# EAGLE design SXV0300_Servo (EAGLE 9.6.2)
Selectrix Arduino
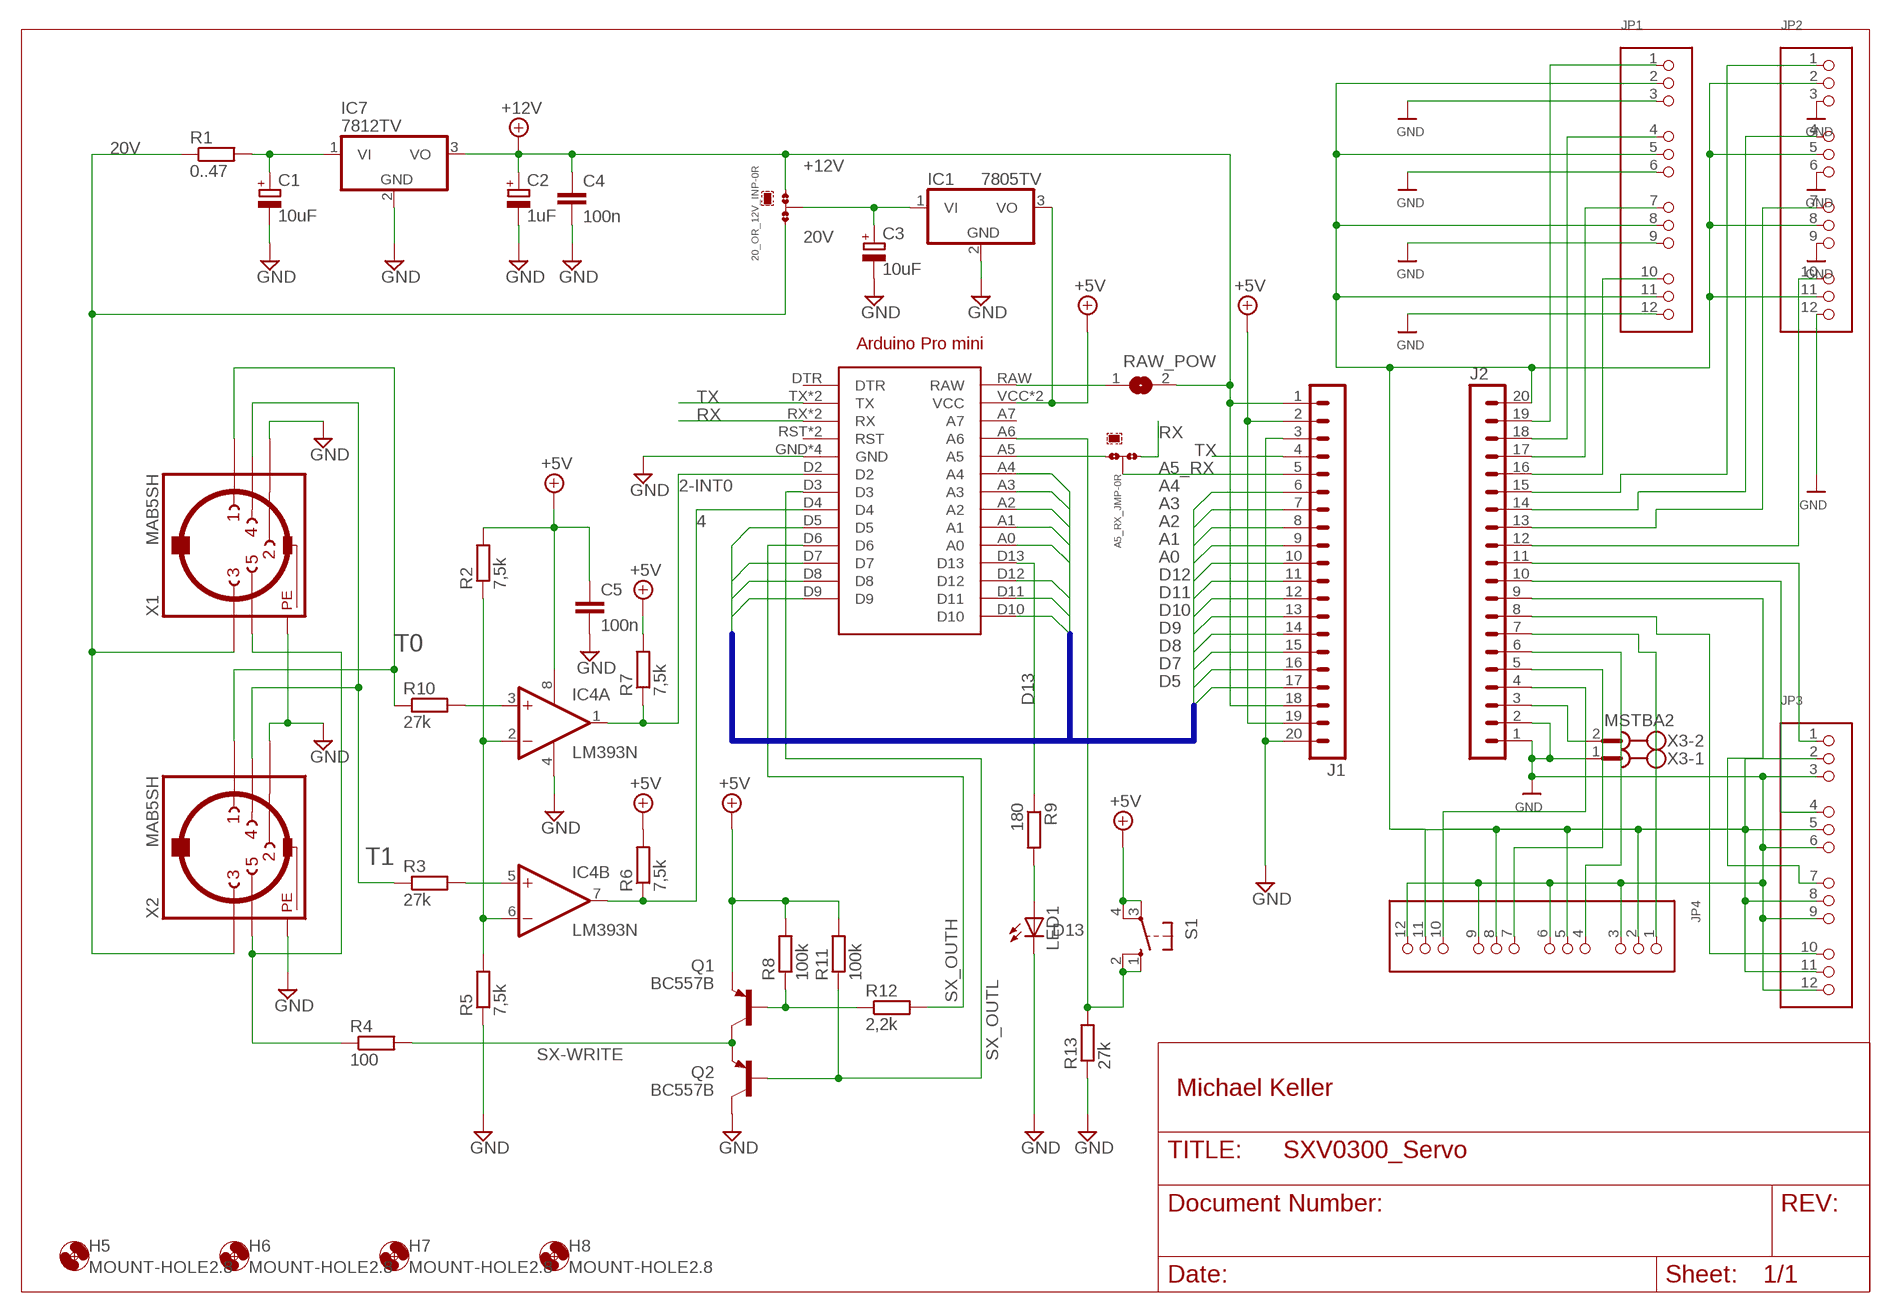
[diagram p0: schematic, sheet 1]

## Parts
20_OR_12V_INP  0R-JUMPA  [A0R-JMP]
A5_RX_JMP  0R-JUMPB  [B0R-JMP]
ARDUINO1  ARDUINO_PRO_MINI  [ARDUINO_PRO_MINI]
C1  10uF  CPOL-EUE2.5-7  [E2,5-7]
C2  1uF  CPOL-EUE2.5-7  [E2,5-7]
C3  10uF  CPOL-EUSMCC  [SMC_C]
C4  100n  C-EU050-025X075  [C050-025X075]
C5  100n  C-EU050-025X075  [C050-025X075]
H5  MOUNT-HOLE2.8  [2,8]
H6  MOUNT-HOLE2.8  [2,8]
H7  MOUNT-HOLE2.8  [2,8]
H8  MOUNT-HOLE2.8  [2,8]
IC1  7805TV  [TO220V]
IC4  LM393N  [DIL08]
IC7  7812TV  [TO220V]
J1  MA20-1  [MA20-1]
J2  MA20-1  [MA20-1]
JP1  HEADER-3X04  [3X04]
JP2  HEADER-3X04  [3X04]
JP3  HEADER-3X04  [3X04]
JP4  HEADER-3X04  [3X04]
LED1  LED3MM  [LED3MM]
Q1  BC557B  [TO92-EBC]
Q2  BC557B  [TO92-EBC]
R1  0..47  R-EU_0207/12  [0207/12]
R2  7,5k  R-EU_0207/10  [0207/10]
R3  27k  R-EU_0207/10  [0207/10]
R4  100  R-EU_0207/10  [0207/10]
R5  7,5k  R-EU_0207/10  [0207/10]
R6  7,5k  R-EU_0207/10  [0207/10]
R7  7,5k  R-EU_0207/10  [0207/10]
R8  100k  R-EU_0207/10  [0207/10]
R9  180  R-EU_0207/2V  [0207/2V]
R10  27k  R-EU_0207/10  [0207/10]
R11  100k  R-EU_0207/10  [0207/10]
R12  2,2k  R-EU_0207/10  [0207/10]
R13  27k  R-EU_0207/10  [0207/10]
RAW_POW  SJ  [SJ]
S1  10-XX  [B3F-10XX]
X1  MAB5SH  [MAB5SH]
X2  MAB5SH  [MAB5SH]
X3  MSTBA2  [MSTBA2]

## Nets
2-INT0: ARDUINO1.D2 IC4.1(A:OUT) R7.1
4: ARDUINO1.D4 IC4.7(B:OUT) R6.1
20V: 20_OR_12V_INP.3 R1.1 X1.3 X2.3
+5V: ARDUINO1.VCC ARDUINO1.VCC@1(VCC) C5.1 IC1.3(VO) IC4.8(P:V+) J1.2 J1.19 Q1.E R2.2 R6.2 R7.2 R8.2 R11.2 S1.3(P) S1.4(P1)
+12V: 20_OR_12V_INP.1 C2.+ C4.1 IC7.3(VO) J1.1 J1.18 RAW_POW.2
A0: ARDUINO1.A0 J1.10
A1: ARDUINO1.A1 J1.9
A2: ARDUINO1.A2 J1.8
A3: ARDUINO1.A3 J1.7
A4: ARDUINO1.A4 J1.6
A5: A5_RX_JMP.3 ARDUINO1.A5
A5_RX: A5_RX_JMP.2 J1.5
D5: ARDUINO1.D5 J1.17
D7: ARDUINO1.D7 J1.16
D8: ARDUINO1.D8 J1.15
D9: ARDUINO1.D9 J1.14
D10: ARDUINO1.D10 J1.13
D11: ARDUINO1.D11 J1.12
D12: ARDUINO1.D12 J1.11
D13: ARDUINO1.D13 R9.1
GND: ARDUINO1.GND ARDUINO1.GND@1(GND) ARDUINO1.GND@2(GND) ARDUINO1.GND@3(GND) C1.- C2.- C3.- C4.2 C5.2 IC1.2(GND) IC4.4(P:V-) IC7.2(GND) J1.3 J1.20 J2.1 J2.2 JP1.3 JP1.6 JP1.9 JP1.12 JP2.3 JP2.6 JP2.9 JP2.12 JP3.3 JP3.6 JP3.9 JP3.12 JP4.3 JP4.6 JP4.9 JP4.12 LED1.K(C) Q2.C R5.1 R13.1 X1.2 X1.PE X1.PE@1(PE) X1.PE@2(PE) X1.PE@(PE) X2.2 X2.PE X2.PE@1(PE) X2.PE@2(PE) X2.PE@(PE) X3.1
N$1: LED1.A R9.2
N$2: C1.+ IC7.1(VI) R1.2
N$3: R4.1 X1.5 X2.5
N$4: IC4.3(A:+IN) R10.2
N$5: IC4.5(B:+IN) R3.2
N$6: J2.20 JP1.2 JP1.5 JP1.8 JP1.11 JP2.2 JP2.5 JP2.8 JP2.11 JP3.2 JP3.5 JP3.8 JP3.11 JP4.2 JP4.5 JP4.8 JP4.11
N$7: IC4.2(A:-IN) IC4.6(B:-IN) R2.1 R5.2
N$9: J2.3 X3.2
N$10: J2.4 JP4.10
N$11: J2.5 JP4.7
N$12: J2.6 JP4.4
N$13: J2.7 JP4.1
N$14: J2.8 JP3.10
N$15: J2.9 JP3.7
N$16: J2.10 JP3.4
N$17: J2.11 JP3.1
N$18: J2.12 JP2.10
N$19: J2.13 JP2.7
N$20: J2.14 JP2.4
N$21: J2.15 JP2.1
N$22: J2.16 JP1.10
N$23: J2.17 JP1.7
N$24: J2.18 JP1.4
N$25: J2.19 JP1.1
N$27: ARDUINO1.A6 R13.2 S1.1(S) S1.2(S1)
N$28: Q1.B R8.1 R12.1
N$29: ARDUINO1.RAW RAW_POW.1
N$30: 20_OR_12V_INP.2 C3.+ IC1.1(VI)
RX: A5_RX_JMP.1 ARDUINO1.RX ARDUINO1.RX@1(RX)
SX-WRITE: Q1.C Q2.E R4.2
SX_OUTH: ARDUINO1.D6 R12.2
SX_OUTL: ARDUINO1.D3 Q2.B R11.1
T0: R10.1 X1.1 X2.1
T1: R3.1 X1.4 X2.4
TX: ARDUINO1.TX ARDUINO1.TX@1(TX) J1.4
Unconnected: ARDUINO1.A7 ARDUINO1.DTR ARDUINO1.RST ARDUINO1.RST@1(RST)

## Buses
D5,D[7..12],A[0..4]

## Notes on the sheet
- Michael Keller

## Library data of the parts
20_OR_12V_INP A5_RX_JMP = jump-0r-smd:0R-JUMP: SMD 0R 0805 Jumper
ARDUINO1 = arduinopromini:ARDUINO_PRO_MINI: For creating Arduino Pro Mini shields
C1 C2 = rcl:CPOL-EU: POLARIZED CAPACITOR, European symbol
C3 = resistor:CPOL-EU: POLARIZED CAPACITOR, European symbol
C4 C5 = rcl:C-EU: CAPACITOR, European symbol
H5-H8 = holes:MOUNT-HOLE: MOUNTING HOLE with drill center marker
IC1 IC7 = linear:78*: Positive VOLTAGE REGULATOR Source: http://cache.national.com/ds/LM/LM78L05.pdf http://www.fairchildsemi.com/ds/LM/LM7805.pdf
IC4 = linear:LM393: COMPARATOR
J1 J2 = con-lstb:MA20-1: PIN HEADER; OC_FARNELL: unknown; OC_NEWARK: unknown
JP1-JP4 = microbuilder:HEADER-3X04
LED1 = led:LED: LED OSRAM: - CHIPLED LG R971, LG N971, LY N971, LG Q971, LY Q971, LO R971, LY R971 LH N974, LH R974 LS Q976, LO Q976, LY Q976 LO Q996 - Hyper CHIPLED LW Q18S LB Q993, LB Q99A, LB R99A - SideLED LS A670, LO A670, LY A670, LG A670, LP A670 LB A673, LV A673, LT A673, LW A673 LH A674 LY A675 LS A676, LA A676, LO A676, LY A676, LW A676 LS A679, LY A679, LG A679 - Hyper Micro SIDELED® LS Y876, LA Y876, LO Y876, LY Y876 LT Y87S - SmartLED LW L88C, LW L88S LB L89C, LB L89S, LG L890 LS L89K, LO L89K, LY L89K LS L896, LA L896, LO L896, LY L896 - TOPLED LS T670, LO T670, LY T670, LG T670, LP T670 LSG T670, LSP T670, LSY T670, LOP T670, LYG T670 LG T671, LOG T671, LSG T671 LB T673, LV T673, LT T673, LW T673 LH T674 LS T676, LA T676, LO T676, LY T676, LB T676, LH T676, LSB T676, LW T676 LB T67C, LV T67C, LT T67C, LS T67K, LO T67K, LY T67K, LW E67C LS E67B, LA E67B, LO E67B, LY E67B, LB E67C, LV E67C, LT E67C LW T67C LS T679, LY T679, LG T679 LS T770, LO T770, LY T770, LG T770, LP T770 LB T773, LV T773, LT T773, LW T773 LH T774 LS E675, LA E675, LY E675, LS T675 LS T776, LA T776, LO T776, LY T776, LB T776 LHGB T686 LT T68C, LB T68C - Hyper Mini TOPLED® LB M676 - Mini TOPLED Santana® LG M470 LS M47K, LO M47K, LY M47K Source: http://www.osram.convergy.de LUXEON: - LUMILED® LXK2-PW12-R00, LXK2-PW12-S00, LXK2-PW14-U00, LXK2-PW14-V00 LXK2-PM12-R00, LXK2-PM12-S00, LXK2-PM14-U00 LXK2-PE12-Q00, LXK2-PE12-R00, LXK2-PE12-S00, LXK2-PE14-T00, LXK2-PE14-U00 LXK2-PB12-K00, LXK2-PB12-L00, LXK2-PB12-M00, LXK2-PB14-N00, LXK2-PB14-P00, LXK2-PB14-Q00 LXK2-PR12-L00, LXK2-PR12-M00, LXK2-PR14-Q00, LXK2-PR14-R00 LXK2-PD12-Q00, LXK2-PD12-R00, LXK2-PD12-S00 LXK2-PH12-R00, LXK2-PH12-S00 LXK2-PL12-P00, LXK2-PL12-Q00, LXK2-PL12-R00 Source: www.luxeon.com KINGBRIGHT: KA-3528ASYC Source: www.kingbright.com
Q1 Q2 = transistor-pnp:BC557*: PNP Transistror
R1-R13 = rcl:R-EU_: RESISTOR, European symbol
RAW_POW = jumper:SJ: SMD solder JUMPER
S1 = switch-omron:10-XX: OMRON SWITCH; MPN: B3F-1000; OC_FARNELL: 176432; OC_NEWARK: 36M3542
X1 X2 = con-hirschmann_Tha:MAB5SH: Female CONNECTOR 5 pins 90 deg. with shield, horizontal (DIN 41524); OC_FARNELL: 809883; OC_NEWARK: unknown
X3 = con-phoenix-508:MSTBA2: PHOENIX; MF: FARNELL; MPN: 1757242; OC_FARNELL: 3705171; OC_NEWARK: 71C4161

## Board
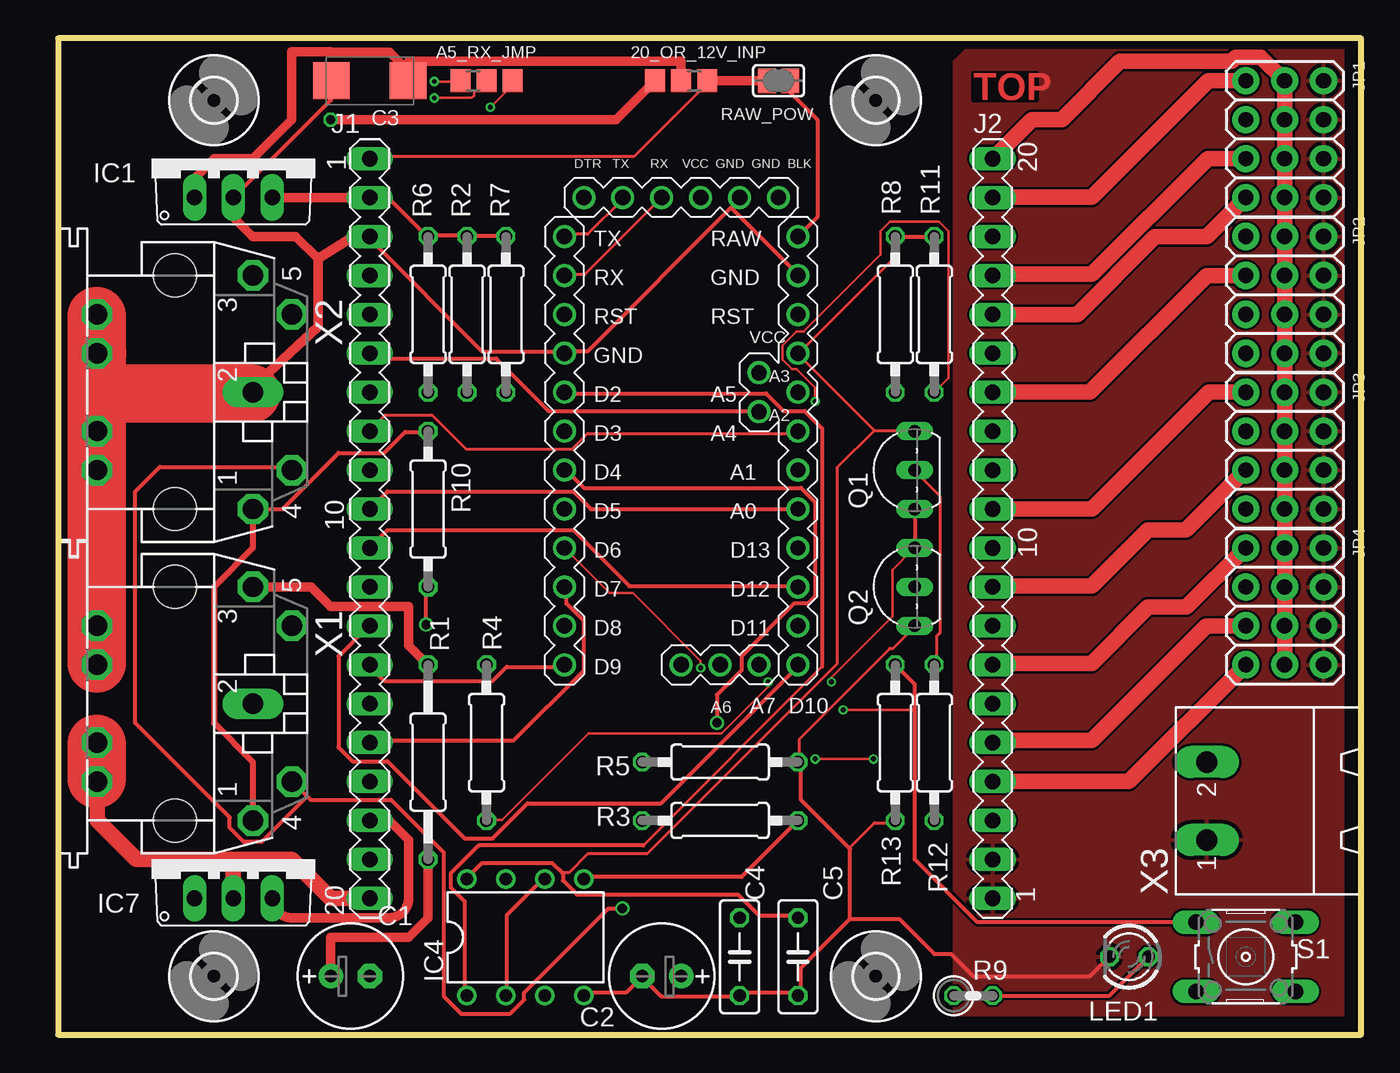
[diagram p1: board, top side]
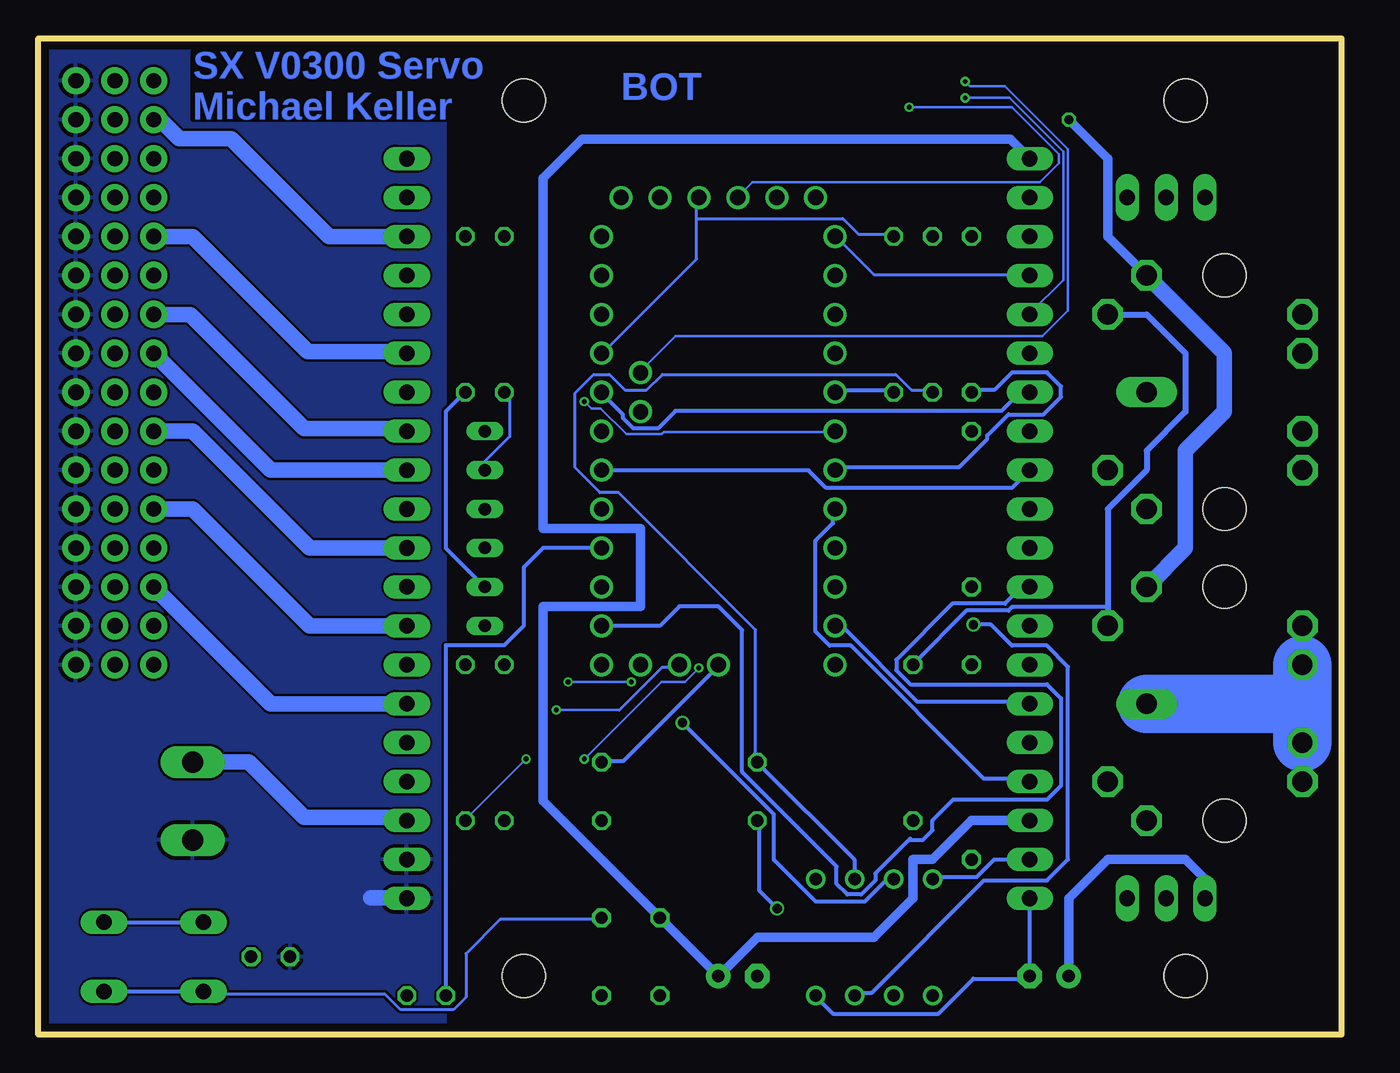
[diagram p2: board, bottom side, seen from below]

Size 85 x 65 mm. Coordinates in mm from the lower left corner, seen from the top.
Outline: 0,0 85,0 85,65 0,65 0,0
Copper layers (1*16): Top 0.035mm / dielectric 1.6mm / Bottom 0.035mm
Design rules "Elecrow_2-layer_PCB_eagle_rule": minimum track width 6mil, minimum drill 12mil, track to track 6mil, track to pad 6mil, pad to pad 6mil, via to via 8mil, smd to smd 0mil, copper to edge 20mil, drill to drill 10mil, minimum pad ring 6mil, minimum via ring 6mil, stop-mask expansion 0mil, vias tented up to drill 100mil, thermal gap 10mil

### Footprints (pad centres in the part's own frame; a part is rotated, then mirrored left to right if it is on the bottom)
A0R-JMP = smd 1.5 x 1.3: 1 0,1.7; 2 0,0; 3 0,-1.7
B0R-JMP = smd 1.5 x 1.3: 1 0,1.7; 2 0,0; 3 0,-1.7
ARDUINO_PRO_MINI = drill 1: A0 11.43,-8.89; A1 11.43,-6.35; A2 11.43,-3.81; A3 11.43,-1.27; A4 8.89,-2.54; A5 8.89,0; A6 6.35,-19.05; A7 8.89,-19.05; BLK 10.16,11.43; D2 -3.81,-1.27; D3 -3.81,-3.81; D4 -3.81,-6.35; D5 -3.81,-8.89; D6 -3.81,-11.43; D7 -3.81,-13.97; D8 -3.81,-16.51; D9 -3.81,-19.05; D10 11.43,-19.05; D11 11.43,-16.51; D12 11.43,-13.97; D13 11.43,-11.43; DTR -2.54,11.43; GND -3.81,1.27; GND@1 11.43,6.35; GND@2 7.62,11.43; GND@3 3.81,-19.05; RAW 11.43,8.89; RST 11.43,3.81; RST@1 -3.81,3.81; RX -3.81,6.35; RX@1 2.54,11.43; TX -3.81,8.89; TX@1 0,11.43; VCC 11.43,1.27; VCC@1 5.08,11.43
E2,5-7 = drill 0.813 pad 1.6: + -1.27,0 | drill 0.813 pad 1.6 octagon: - 1.27,0
SMC_C = smd 2.4 x 2.4: + -2.5,0; - 2.5,0
C050-025X075 = drill 0.813 octagon: 1 -2.54,0; 2 2.54,0
2,8 = hole 2.8: 0,0
TO220V = drill 1.016 long: 1 -2.54,-2.54; 2 0,-2.54; 3 2.54,-2.54
DIL08 = drill 0.813 pad 1.27: 1 -3.81,-3.81; 2 -1.27,-3.81; 3 1.27,-3.81; 4 3.81,-3.81; 5 3.81,3.81; 6 1.27,3.81; 7 -1.27,3.81; 8 -3.81,3.81
MA20-1 = drill 1.016 long: 1 -24.13,0; 2 -21.59,0; 3 -19.05,0; 4 -16.51,0; 5 -13.97,0; 6 -11.43,0; 7 -8.89,0; 8 -6.35,0; 9 -3.81,0; 10 -1.27,0; 11 1.27,0; 12 3.81,0; 13 6.35,0; 14 8.89,0; 15 11.43,0; 16 13.97,0; 17 16.51,0; 18 19.05,0; 19 21.59,0; 20 24.13,0
3X04 = drill 1 pad 1.778: 1 -3.81,-2.54; 2 -3.81,0; 3 -3.81,2.54; 4 -1.27,-2.54; 5 -1.27,0; 6 -1.27,2.54; 7 1.27,-2.54; 8 1.27,0; 9 1.27,2.54; 10 3.81,-2.54; 11 3.81,0; 12 3.81,2.54
LED3MM = drill 0.813 octagon: A -1.27,0; K 1.27,0
TO92-EBC = drill 0.813 long: B 0,-1.27; C -2.54,-1.27; E 2.54,-1.27
0207/12 = drill 0.813 octagon: 1 -6.35,0; 2 6.35,0
0207/10 = drill 0.813 octagon: 1 -5.08,0; 2 5.08,0
0207/2V = drill 0.813 octagon: 1 -1.27,0; 2 1.27,0
SJ = smd 1.168 x 1.6: 1 -0.762,0; 2 0.762,0
B3F-10XX = drill 1.016 long: 1 -3.251,2.261; 2 3.251,2.261; 3 -3.251,-2.261; 4 3.251,-2.261
MAB5SH = drill 1.321 octagon: 1 7.62,5.08; 3 -7.62,5.08; 4 5.08,7.62; 5 -5.08,7.62; PE -2.54,-5.08; PE@ 2.54,-5.08; PE@1 -5.08,-5.08; PE@2 5.08,-5.08 | drill 1.321 long: 2 0,5.08 | hole 2.794: 7.62,0; -7.62,0
MSTBA2 = drill 1.397 long: 1 -2.54,5.08; 2 2.54,5.08

### Placement (x,y rotation side)
20_OR_12V_INP  40.64,62.23 270 top
A5_RX_JMP  27.94,62.23 270 top
ARDUINO1  36.83,43.18 0 top
C1  19.05,3.81 0 top
C2  39.37,3.81 180 top
C3  20.32,62.23 180 top
C4  44.45,5.08 270 top
C5  48.26,5.08 270 top
H5  10.16,60.96 0 top
H6  53.34,60.96 0 top
H7  10.16,3.81 0 top
H8  53.34,3.81 0 top
IC1  11.43,57.15 0 top
IC4  30.48,6.35 0 top
IC7  11.43,11.43 0 top
J1  20.32,33.02 270 top
J2  60.96,33.02 90 top
JP1  80.01,58.42 270 top
JP2  80.01,48.26 270 top
JP3  80.01,38.1 270 top
JP4  80.01,27.94 270 top
LED1  69.85,5.08 180 top
Q1  54.61,36.83 90 top
Q2  54.61,29.21 90 top
R1  24.13,17.78 270 top
R2  26.67,46.99 90 top
R3  43.18,13.97 0 top
R4  27.94,19.05 270 top
R5  43.18,17.78 180 top
R6  24.13,46.99 90 top
R7  29.21,46.99 90 top
R8  54.61,46.99 90 top
R9  59.69,2.54 0 top
R10  24.13,34.29 270 top
R11  57.15,46.99 90 top
R12  57.15,19.05 270 top
R13  54.61,19.05 90 top
RAW_POW  46.99,62.23 180 top
S1  77.47,5.08 0 top
X1  7.62,21.59 270 top
X2  7.62,41.91 270 top
X3  80.01,15.24 90 top

### Tracks (layer width: path | path; a pad name or v marks a point on that pad's centre or on a via)
2-INT0
  Top 0.203: 38.18,12.34 38.2,12.39 49.78,23.98 49.84,24
  Top 0.254: 38.18,12.34 27.43,12.34 25.6,10.52 25.6,9.6 26.52,8.69 26.52,2.74 IC4.1 | 49.84,24 49.84,39.55 48.69,40.69 47.32,40.69 46.18,41.83 33.15,41.83 ARDUINO1.D2
  Bottom 0.254: R7.1 29.26,42.06 32.92,42.06 ARDUINO1.D2
4  (via drill 0.61)
  Top 0.254: v42.98,20.34 42.98,22.17 44.58,23.77 44.58,24.69 48.01,28.12 48.92,28.12 49.38,28.57 49.38,34.75 48.46,35.66 34.29,35.66 33.15,36.8 ARDUINO1.D4
  Bottom 0.254: R6.1 24,42.06 22.63,42.06 21.49,43.2 19.2,43.2 18.29,42.29 18.29,41.6 19.43,40.46 21.72,40.46 23.09,39.09 23.09,38.86 24.92,37.03 32.92,37.03 ARDUINO1.D4 | v42.98,20.34 37.03,14.4 37.03,11.43 34.29,8.69 31.09,8.69 29.72,10.06 29.26,10.06 IC4.7
20V  (via drill 0.6)
  Top 0.61: X1.3 16.51,29.21 17.78,27.94 22.86,27.94 22.86,25.4 R1.1 | v17.78,59.69 36.4,59.69 20_OR_12V_INP.3
  Bottom 0.61: X2.3 15.24,52.07 15.24,57.15 v17.78,59.69
  Bottom 1.016: X2.3 7.62,44.45 7.62,40.64 10.16,38.1 10.16,31.75 X1.3
+5V
  Top 0.203: 53.24,39.42 55.88,39.42 Q1.E | 53.24,39.42 48.36,44.3 ARDUINO1.VCC 48.36,44.5 54.46,50.6 54.46,52.02 R8.2 | 53.24,39.42 50.8,36.98 50.8,24.18 38.41,11.79 34.54,11.79 33.33,10.57 32.92,10.57 32.89,10.54
  Top 0.254: C5.1 48.23,7.77 45.72,7.77 44.35,9.14 33.83,9.14 32.92,10.06 32.92,10.52 32.89,10.54 32.23,11.2 27.66,11.2 26.75,10.29 IC4.8 | R7.2 29.03,52.12 26.75,52.12 R2.2 26.52,52.12 24.23,52.12 R6.2 24,52.12 21.72,54.41 20.34,54.41 J1.2 | R8.2 R11.2
  Top 0.61: IC1.3 J1.2
  Bottom 0.203: S1.3 74.17,2.64 62.38,2.64 61.37,1.63 57.91,1.63 57.1,2.44 57.1,5.28 54.86,7.52 48.36,7.52 C5.1 | 42.06,53.24 42.06,50.6 48.16,44.5 ARDUINO1.VCC | 42.06,53.24 42.06,54.46 ARDUINO1.VCC@1 | 42.06,53.24 32.51,53.24 31.5,52.22 29.26,52.22 R7.2
  Bottom 0.254: J1.19 22.63,11.43 23.77,10.29 26.52,10.29 IC4.8 | S1.4 S1.3
+12V
  Top 0.203: 20_OR_12V_INP.1 42.27,61.98 37.59,57.3 20.32,57.3 J1.1
  Top 0.61: IC7.3 arc90 15.24,7.62 21.59,7.62 arc90 22.86,8.89 22.86,12.7 21.59,13.97 J1.18 | 20_OR_12V_INP.1 RAW_POW.2
  Bottom 0.61: J1.18 24.13,13.97 26.67,11.43 27.94,11.43 27.94,8.89 30.48,6.35 38.1,6.35 C2.+ C4.1 52.07,15.24 52.07,27.94 45.72,27.94 45.72,33.02 52.07,33.02 52.07,55.88 49.53,58.42 21.59,58.42 J1.1
A0
  Top 0.254: ARDUINO1.A0 34.75,34.29 33.6,35.43 21.49,35.43 20.34,34.29 J1.10
A1
  Bottom 0.254: J1.9 21.49,35.66 33.6,35.66 34.75,36.8 48.23,36.8 ARDUINO1.A1
A2
  Top 0.203: ARDUINO1.A2 48.16,39.22 34.54,39.22 33.53,38.2 26.62,38.2 24.38,40.44 21.34,40.44 20.32,39.42 J1.8
A3
  Bottom 0.254: ARDUINO1.A3 48.23,41.83 46.86,40.46 46.86,40.23 46.18,39.55 44.58,39.55 43.43,40.69 22.17,40.69 21.03,41.83 20.34,41.83 J1.7
A4
  Top 0.254: ARDUINO1.A4 45.72,40.69 32,40.69 28.57,44.12 20.57,44.12 20.34,44.35 J1.6
A5  (via drill 0.3)
  Top 0.152: v24.54,62.18 26.21,62.18 A5_RX_JMP.3
  Bottom 0.152: ARDUINO1.A5 45.72,43.28 43.43,45.57 19.51,45.57 17.83,47.24 17.83,57.76 21.95,61.87 24.23,61.87 v24.54,62.18
A5_RX  (via drill 0.3)
  Top 0.152: A5_RX_JMP.2 27.13,61.42 27.13,61.27 26.98,61.11 v24.54,61.11
  Bottom 0.152: v24.54,61.11 21.64,61.11 18.14,57.61 18.14,49.23 20.27,47.09 J1.5
D5
  Bottom 0.254: ARDUINO1.D5 33.15,34.29 33.15,33.38 34.29,32.23 34.29,26.29 33.38,25.38 32,25.38 23.32,16.69 20.34,16.69 J1.17
D7
  Top 0.254: ARDUINO1.D7 33.15,29.03 33.15,28.12 34.29,26.98 34.29,23.77 29.72,19.2 20.34,19.2 J1.16
D8
  Bottom 0.254: ARDUINO1.D8 32.92,26.52 32.46,26.52 27.66,21.72 20.34,21.72 J1.15
D9
  Top 0.254: ARDUINO1.D9 32.92,24 29.26,24 28.35,23.09 21.26,23.09 20.34,24 J1.14
D10
  Top 0.254: ARDUINO1.D10 48.23,24 39.32,15.09 30.63,15.09 28.35,12.8 26.52,12.8 21.49,17.83 19.2,17.83 18.29,18.75 18.29,24.69 20.12,26.52 J1.13
D11
  Bottom 0.254: J1.12 20.34,29.03 21.03,29.03 21.95,28.12 25.38,28.12 29.03,24.46 29.03,23.77 28.12,22.86 19.2,22.86 18.29,21.95 18.29,16.23 19.2,15.32 25.32,15.32 26.67,13.97 26.67,13.34 27.3,12.7 28.12,12.7 28.12,12.8 30.4,10.52 30.4,10.06 31.32,9.14 32.23,9.14 32.92,9.83 32.92,10.97 39.09,17.14 39.09,26.39 40.64,27.94 43.18,27.94 44.45,26.67 ARDUINO1.D11
D12
  Top 0.254: J1.11 21.49,32.92 33.6,32.92 37.26,29.26 48.23,29.26 ARDUINO1.D12
D13
  Bottom 0.254: ARDUINO1.D13 52.07,31.75 53.34,30.48 53.34,26.67 54.61,25.4 58.42,25.4 R9.1
GND
  Top 0.203: ARDUINO1.GND@2 44.3,54.46 44.35,54.41 | R13.1 54.46,13.82 53.24,13.82 51.61,12.19 51.66,12.12 | Q2.C 55.88,26.62 54.46,25.2 54.25,25.2 48.36,19.3 48.36,17.88 R5.1 | 48.46,2.85 48.16,2.85 C5.2
  Top 0.254: 2.52,37.03 X2.PE@2 2.52,36.8 | 2.52,39.32 X2.PE@ 2.52,39.55 | 2.52,44.58 X2.PE | 2.52,46.86 X2.PE@1 | 2.52,16.69 X1.PE@2 | 2.52,18.97 X1.PE@ | 2.52,24.23 X1.PE | 2.52,26.52 X1.PE@1 2.52,26.75 | X2.2 12.57,41.83 13.72,43.2 | 18.97,51.89 J1.3 20.34,51.89 27.66,44.58 32.92,44.58 ARDUINO1.GND 33.15,44.58 34.52,44.58 43.89,53.95 | C5.2 48.23,2.74 44.58,2.74 C4.2 44.35,2.52 39.32,2.52 38.18,3.66 C2.- 37.03,2.74 34.29,2.74 IC4.4 | 51.66,7.54 54.86,7.54 57.15,5.26 58.24,5.26 59.69,3.81 67.31,3.81 LED1.K 68.58,5.26 | 51.66,7.54 48.46,4.34 48.46,2.85 | 44.35,54.41 43.89,53.95 | 43.89,53.95 48.23,49.61 ARDUINO1.GND@1 | 51.66,7.54 51.66,12.12 48.46,15.32 48.46,17.6 R5.1 | IC1.2 17.78,60.96 C3.-
  Top 0.61: 16.94,50.62 18.97,51.89 | 16.94,50.62 16.94,46.18 13.72,43.2 | IC1.2 11.43,53.34 12.7,52.07 15.49,52.07 16.94,50.62
  Top 1.016: X1.PE@2 2.54,13.97 5.08,11.43 11.43,11.43 | IC7.2 11.43,11.43 | 11.43,11.43 15.24,11.43 17.78,8.89 J1.20
  Top 3.81: 2.52,39.32 2.52,37.03 | 2.52,46.86 2.52,44.58 | 2.52,41.83 2.52,44.35 X2.PE | 2.52,41.83 2.52,39.55 | 2.52,18.97 2.52,16.69 | 2.52,26.52 2.52,24.23 | 2.52,26.75 2.52,36.8 | 2.52,41.83 12.57,41.83
  Bottom 0.254: R5.1 48.23,17.83 46.86,17.83 40.69,24 ARDUINO1.GND@3 | J1.20 20.34,8.69 20.34,3.89 C1.- 20.34,3.66 24,3.66 26.29,1.37 33.15,1.37 34.29,2.52 IC4.4 | 61.04,8.91 J2.1
  Bottom 1.016: 63.32,8.91 61.04,8.91
  Bottom 3.81: X1.PE 2.54,21.59 | 2.54,21.59 X1.PE@ | X1.2 2.54,21.59
  pour Bottom: 85.09,0 85.09,64.77 58.42,64.77 58.42,0
  pour Top: 83.82,64.77 83.82,1.27 58.42,1.27 58.42,63.5 59.69,64.77
N$1
  Top 0.254: R9.2 68.58,2.54 LED1.A
N$2
  Top 0.61: R1.2 24.13,7.62 22.86,6.35 17.78,6.35 C1.+
  Bottom 0.61: C1.+ 17.78,8.89 15.24,11.43 10.16,11.43 8.89,10.16 IC7.1
N$3
  Bottom 0.254: 15.24,27.89 21.49,27.89 21.72,27.66 24.46,27.66 27.89,24.23 R4.1
  Bottom 0.406: X2.5 12.7,46.99 10.16,44.45 10.16,40.64 12.7,38.1 12.7,36.83 15.24,34.29 15.24,27.89 X1.5
N$4  (via drill 0.61)
  Top 0.254: v24,26.75 24,29.03 R10.2
  Bottom 0.254: v24,26.75 22.86,26.75 21.49,25.38 19.2,25.38 17.83,24 17.83,11.43 19.2,10.06 23.32,10.06 30.63,2.74 31.55,2.74 IC4.3
N$5
  Top 0.254: R3.2 44.58,10.29 34.29,10.29 IC4.5
N$6
  Top 1.016: J2.20 63.52,59.71 65.47,59.71 69.26,63.5 76.55,63.5 76.83,63.78 78.46,63.78 JP1.2 JP1.5 JP1.8 JP1.11 JP2.2 JP2.5 JP2.8 JP2.11 JP3.2 JP3.5 JP3.8 JP3.11 JP4.2 JP4.5 JP4.8 JP4.11
N$7
  Top 0.254: IC4.2 29.26,2.74 29.26,7.77 31.55,10.06 IC4.6
  Bottom 0.203: R2.1 26.82,42.06 28.04,42.06 29.06,43.08 44.3,43.08 45.31,42.06 46.74,42.06 47.75,43.08 48.77,43.08 49.99,41.86 49.99,36.98 48.36,35.36 47.14,35.36 38.2,26.42 38.2,17.88 R5.2
  Bottom 0.254: IC4.6 31.77,10.29 31.77,11.43 37.95,17.6 R5.2
N$9
  Bottom 0.254: 61.04,14.17 J2.3
  Bottom 1.016: 61.04,14.17 67.67,14.17 71.09,17.6 71.27,17.78 X3.2
N$10
  Top 1.016: JP4.10 69.85,16.51 J2.4
N$11
  Top 0.254: 61.04,19.2 J2.5
  Top 1.016: 61.04,19.2 67.44,19.2 74.91,26.67 JP4.7
N$12
  Bottom 1.016: JP4.4 69.85,21.59 J2.6
N$13
  Top 0.254: 61.04,24.23 J2.7
  Top 1.016: 61.04,24.23 67.44,24.23 71.09,27.89 73.61,27.89 JP4.1
N$14
  Bottom 1.016: J2.8 67.31,26.67 74.93,34.29 JP3.10
N$15
  Top 0.254: 61.04,29.26 J2.9
  Top 1.016: 61.04,29.26 67.44,29.26 71.09,32.92 73.56,32.92 JP3.7
N$16
  Bottom 1.016: JP3.4 74.93,39.37 67.31,31.75 J2.10
N$17
  Top 1.016: J2.11 67.44,34.29 75.06,41.91 JP3.1
N$18
  Bottom 1.016: JP2.10 69.85,36.83 J2.12
N$19
  Bottom 0.254: 61.04,39.55 J2.13
  Bottom 1.016: 61.04,39.55 67.67,39.55 75.11,46.99 JP2.7
N$20
  Top 1.016: J2.14 67.31,41.91 74.93,49.53 JP2.4
N$21
  Bottom 0.254: 61.04,44.58 J2.15
  Bottom 1.016: 61.04,44.58 67.44,44.58 74.93,52.07 JP2.1
N$22
  Top 1.016: JP1.10 74.93,52.07 71.55,52.07 66.47,46.99 J2.16
N$23
  Top 0.254: 61.04,49.61 J2.17
  Top 1.016: 61.04,49.61 67.44,49.61 74.98,57.15 JP1.7
N$24
  Bottom 1.016: J2.18 66.04,52.07 72.41,58.44 75.8,58.44 77.05,59.69 JP1.4
N$25
  Top 0.254: 61.04,54.63 J2.19
  Top 1.016: 61.04,54.63 67.44,54.63 75.03,62.23 JP1.1
N$27  (via drill 0.3)
  Top 0.152: 55.88,21.18 v51.21,21.18
  Top 0.254: S1.1 59.97,7.34 55.88,11.43 55.88,21.18 55.88,22.86 R13.2
  Bottom 0.152: v51.21,21.18 47.09,21.18
  Bottom 0.203: 47.09,21.18 44.3,23.98 43.28,23.98 ARDUINO1.A6
  Bottom 0.254: S1.2 S1.1
N$28
  Top 0.203: R12.1 57.3,24.18 57.3,26.01 57.51,26.21 57.51,35.15 55.88,36.78 Q1.B
  Bottom 0.203: Q1.B 55.88,37.39 54.25,39.01 54.25,41.66 54.46,41.86 R8.1
N$29
  Top 0.254: RAW_POW.1 47.75,61.47 49.53,59.69 49.53,53.34 ARDUINO1.RAW
N$30
  Top 0.152: C3.+ 22.86,62.27 22.86,62.87 22.86,63.5 | 17.78,64.14 17.82,64.09
  Top 0.61: 20_OR_12V_INP.2 40.64,63.5 22.86,63.5 | 17.78,64.14 15.24,64.14 15.24,59.69 12.7,57.15 10.16,57.15 8.89,55.88 IC1.1 | 22.86,62.87 21.63,64.09 17.82,64.09
RX  (via drill 0.3)
  Top 0.152: v28.19,60.5 29.57,61.87 29.57,62.18 A5_RX_JMP.1
  Top 0.203: ARDUINO1.RX@1 34.34,49.58 33.12,49.58 ARDUINO1.RX
  Bottom 0.152: v28.19,60.5 21.49,60.5 18.44,57.45 18.44,56.84 19.66,55.63 38.41,55.63 39.32,54.71 ARDUINO1.RX@1
SX-WRITE  (via drill 0.3)
  Top 0.152: v46.33,23.01 46.33,22.71 43.28,19.66 34.59,19.66 28.96,14.02 28.04,14.02 R4.2 | v50.44,23.01 50.44,23.32 54.41,27.28 54.41,30.33 55.78,31.7 Q2.E
  Top 0.254: Q1.C Q2.E
  Bottom 0.152: v50.44,23.01 v46.33,23.01
SX_OUTH  (via drill 0.3)
  Top 0.152: v49.38,17.98 v53.19,17.98 | v41.91,23.93 41.91,24.38 37.49,28.8 35.97,28.8 ARDUINO1.D6
  Bottom 0.152: v53.19,17.98 57.15,14.02 R12.2 | v49.38,17.98 44.35,23.01 42.82,23.01 v41.91,23.93
SX_OUTL  (via drill 0.3)
  Top 0.152: v49.38,41.3 49.38,42.22 48.16,43.43 47.85,43.43 47.24,44.04 47.24,44.96 48.16,45.87 48.62,45.87 53.65,50.9 53.65,52.43 54.25,53.03 57.45,53.03 58.06,52.43 58.06,42.82 R11.1
  Bottom 0.152: v49.38,41.3 48.92,40.84 48.31,40.84 46.63,39.17 44.35,39.17 44.2,39.32 33.07,39.32 ARDUINO1.D3
  Bottom 0.254: R11.1 58.42,40.64 58.42,31.75 Q2.B
T0
  Top 0.254: X2.1 14.63,34.29 18.29,37.95 21.26,37.95 22.63,39.32 24,39.32 R10.1
  Top 0.406: X2.1 12.7,31.75 10.16,29.21 10.16,20.32 12.7,17.78 X1.1
T1  (via drill 0.61)
  Top 0.254: v36.8,8.23 35.89,8.23 30.4,2.74 30.4,2.29 29.49,1.37 26.29,1.37 25.15,2.52 25.15,11.89 21.72,15.32 16.46,15.32 16.23,15.54 | 16.23,15.54 15.32,16.46 X1.4 | 16.23,15.54 13.26,12.57 12.12,12.57 11.2,13.49 11.2,14.17 5.03,20.34 5.03,35.43 6.63,37.03 15.09,37.03 X2.4
  Bottom 0.254: v36.8,8.23 37.95,9.37 37.95,13.95 R3.1
TX
  Top 0.203: ARDUINO1.TX 33.12,52.22 34.54,52.22 36.78,54.46 ARDUINO1.TX@1
  Bottom 0.203: J1.4 20.32,49.58 30.48,49.58 32.92,52.02 ARDUINO1.TX

### Text on the board
Top: TOP
Bottom: BOT | SX V0300 Servo / Michael Keller